# Altium schematic sheet digital_power.SchDoc
size A4; Author: Omri Nissan; Organization: Altium Limited; Address1: -; Address2: San Luis Obispo; Address3: California, 93401; Address4: United States; DocumentNumber: 2; SheetNumber: 2; SheetTotal: 8
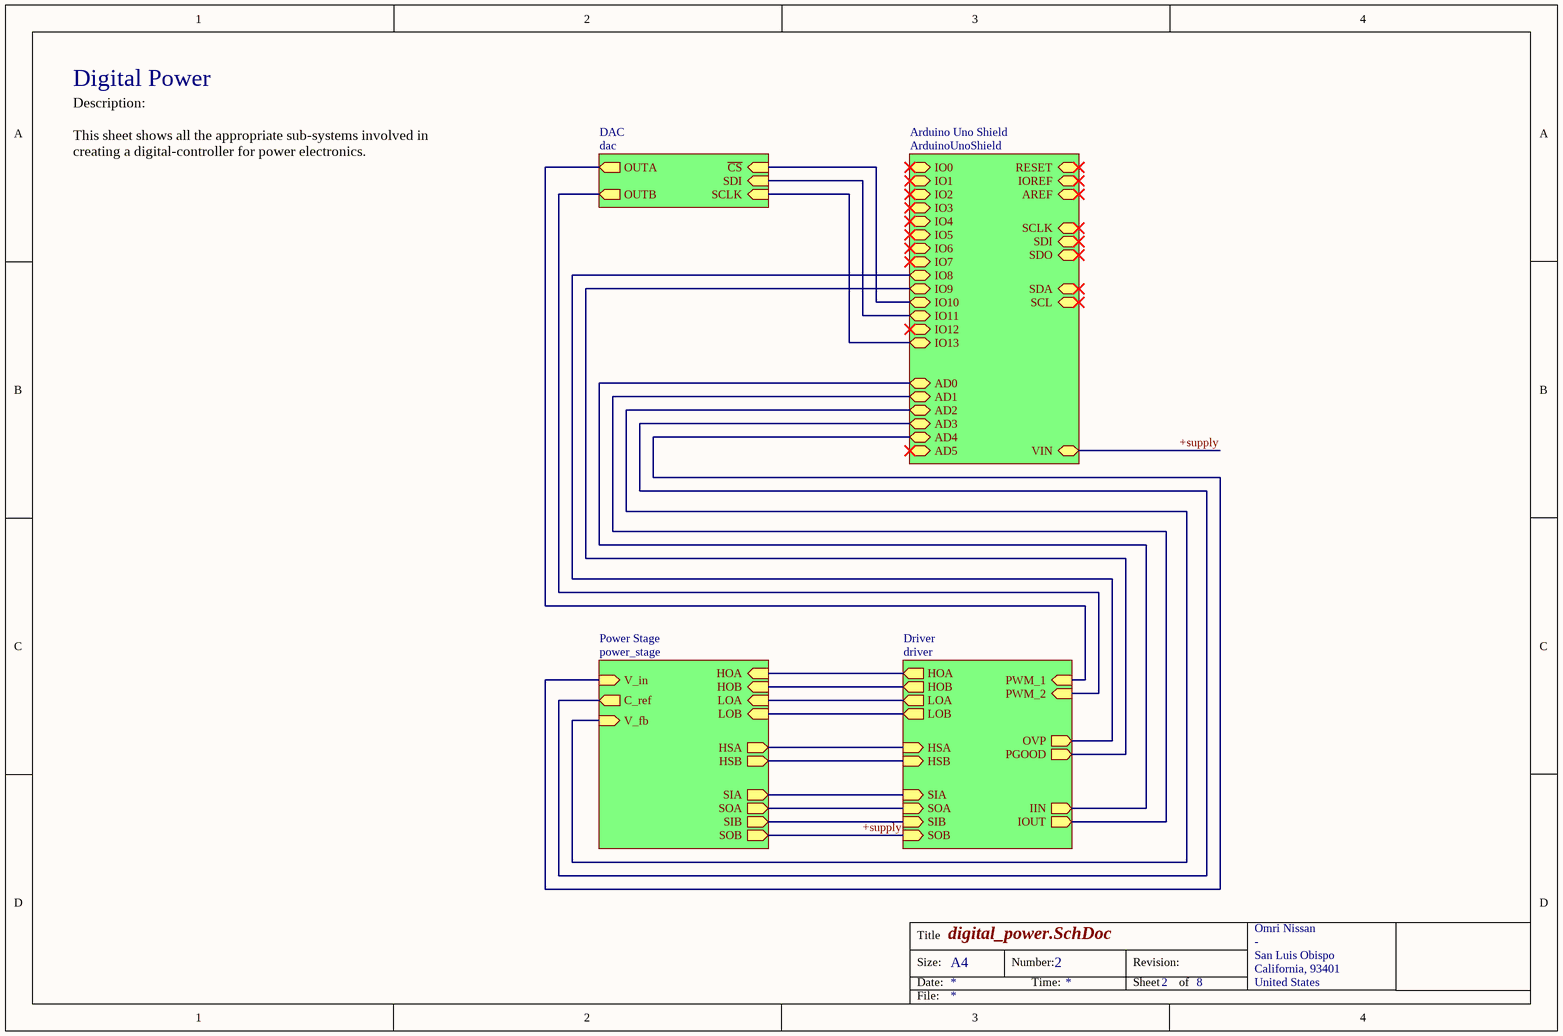
[diagram p0: digital_power.SchDoc]

## Sub-sheets
Arduino Uno Shield = ArduinoUnoShield: AD2 (bidir), IO8 (bidir), SCL (bidir), SCLK (bidir), IO6 (bidir), IO0 (bidir), IO4 (bidir), AD0 (bidir), AD4 (bidir), IOREF (bidir), IO13 (bidir), IO10 (bidir), IO3 (bidir), SDO (bidir), IO1 (bidir), AREF (bidir), AD1 (bidir), AD3 (bidir), SDI (bidir), IO2 (bidir), IO5 (bidir), IO7 (bidir), IO11 (bidir), IO12 (bidir), SDA (bidir), RESET (bidir), IO9 (bidir), AD5 (bidir), VIN (bidir)
DAC = dac: OUTA (out), SCLK (in), ~{CS} (in), SDI (in), OUTB (out)
Driver = driver: OVP (out), PWM_2 (in), HSA (in), HSB (in), HOA (out), LOA (out), IOUT (out), HOB (out), IIN (out), LOB (out), PWM_1 (in), PGOOD (out), SOA (in), SIB (in), SOB (in), SIA (in)
Power Stage = power_stage: V_fb (in), HSA (out), HSB (out), LOA (in), LOB (in), HOB (in), HOA (in), C_ref (out), SIA (out), SIB (out), SOA (out), SOB (out), V_in (in)

## Nets
+supply: sheet Power Stage/SOB, sheet Arduino Uno Shield/VIN, sheet Driver/SOB
(unnamed): sheet Power Stage/V_fb, sheet Arduino Uno Shield/AD2
(unnamed): sheet Power Stage/HSA, sheet Driver/HSA
(unnamed): sheet Power Stage/HSB, sheet Driver/HSB
(unnamed): sheet Power Stage/LOA, sheet Driver/LOA
(unnamed): sheet Power Stage/LOB, sheet Driver/LOB
(unnamed): sheet Power Stage/HOB, sheet Driver/HOB
(unnamed): sheet Power Stage/HOA, sheet Driver/HOA
(unnamed): sheet Power Stage/C_ref, sheet Arduino Uno Shield/AD3
(unnamed): sheet Power Stage/SIA, sheet Driver/SIA
(unnamed): sheet Power Stage/SIB, sheet Driver/SIB
(unnamed): sheet Power Stage/SOA, sheet Driver/SOA
(unnamed): sheet Power Stage/V_in, sheet Arduino Uno Shield/AD4
(unnamed): sheet Arduino Uno Shield/IO8, sheet Driver/OVP
(unnamed): sheet Arduino Uno Shield/AD0, sheet Driver/IIN
(unnamed): sheet Arduino Uno Shield/IO13, sheet DAC/SCLK
(unnamed): sheet Arduino Uno Shield/IO10, sheet DAC/~{CS}
(unnamed): sheet Arduino Uno Shield/AD1, sheet Driver/IOUT
(unnamed): sheet Arduino Uno Shield/IO11, sheet DAC/SDI
(unnamed): sheet Arduino Uno Shield/IO9, sheet Driver/PGOOD
(unnamed): sheet Driver/PWM_2, sheet DAC/OUTB
(unnamed): sheet Driver/PWM_1, sheet DAC/OUTA

## Notes on the sheet
- Digital Power
- Description:
  This sheet shows all the appropriate sub-systems involved in creating a digital-controller for power electronics.
- Title
- Size:
- Date:
- A4
- Number:
- Time:
- Revision:
- Sheet
- of
- File: